# EAGLE design hs_pcb (EAGLE 5.12)
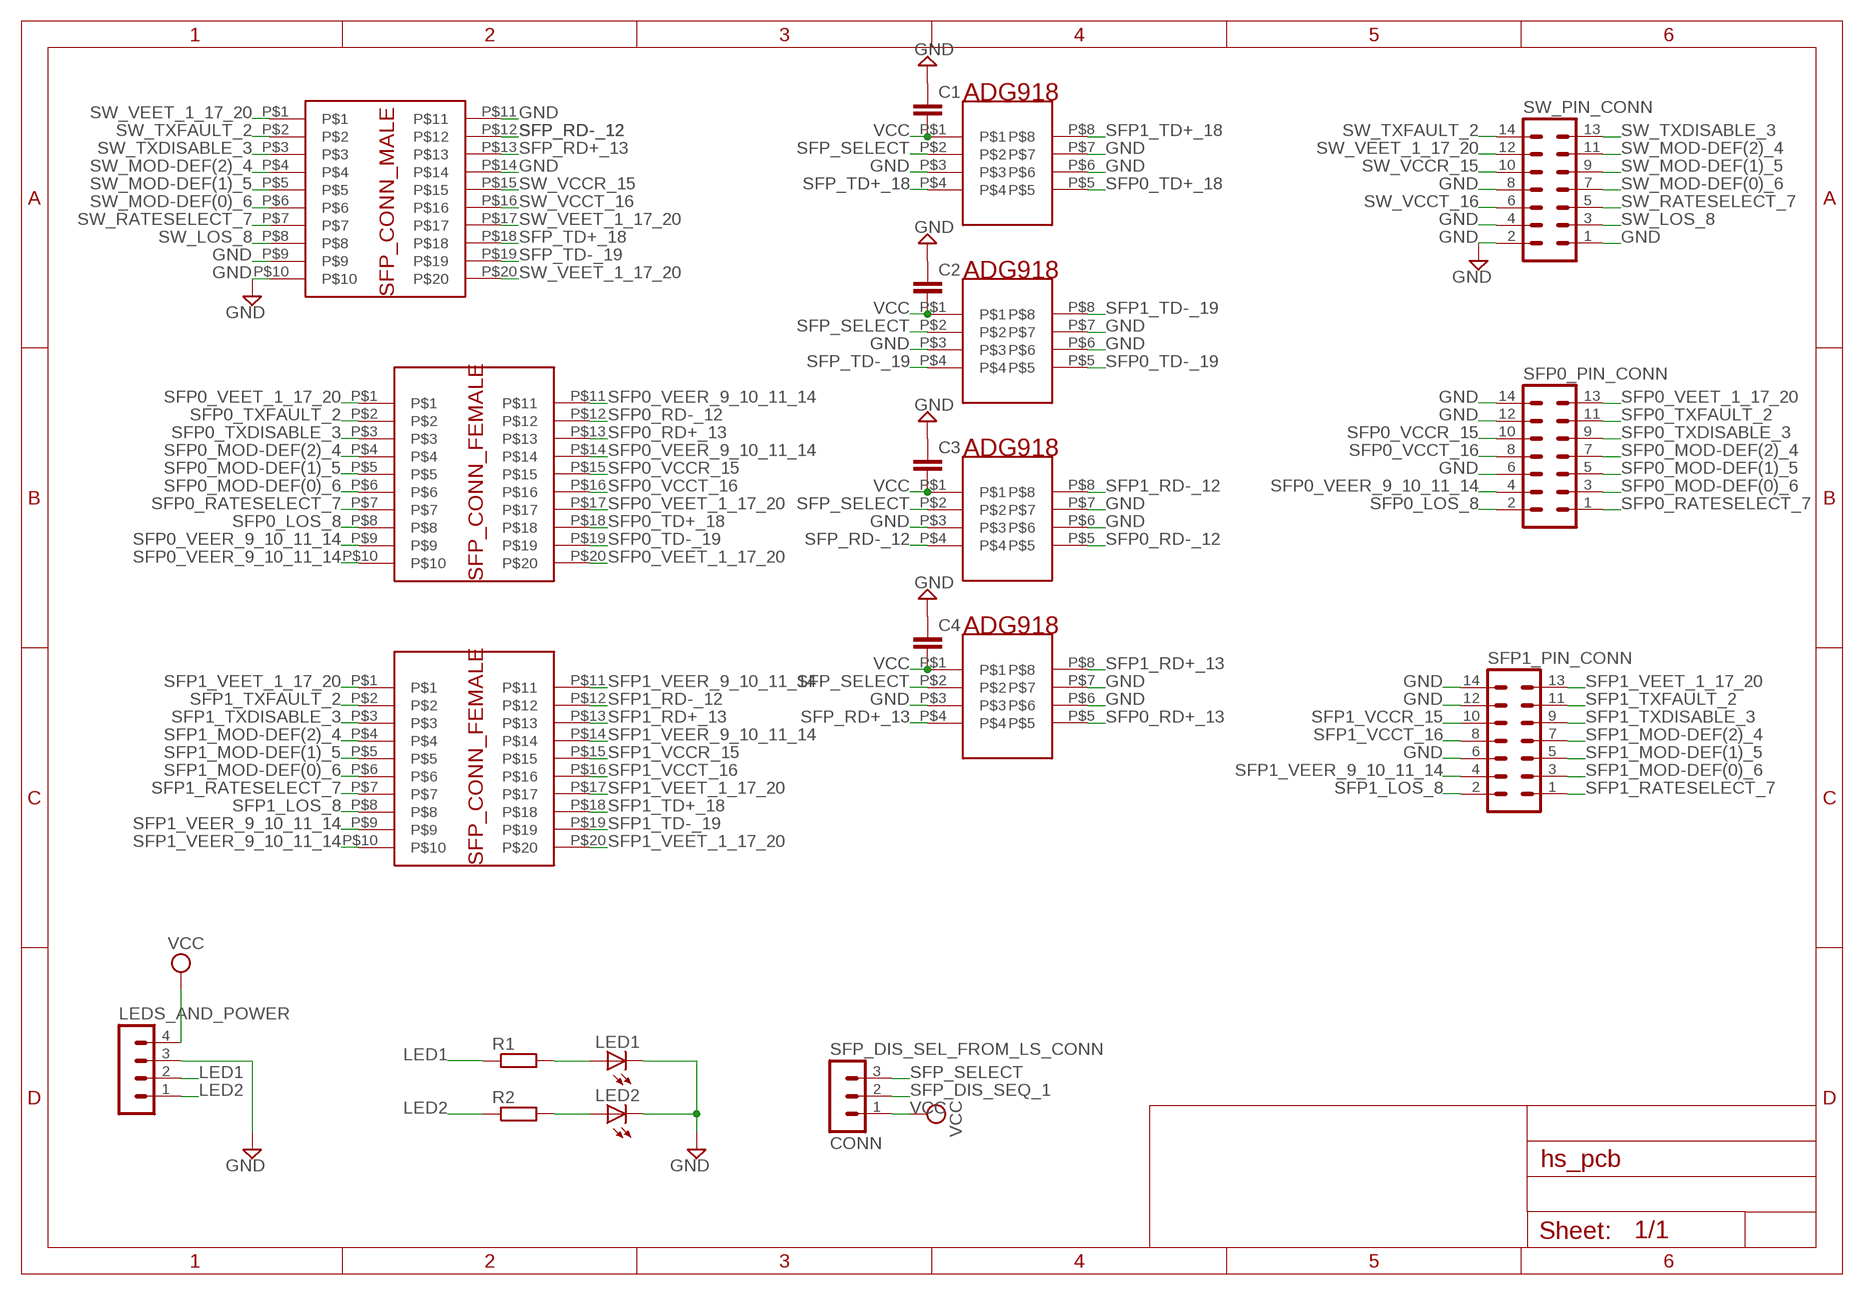
[diagram p0: schematic, sheet 1]

## Parts
C1  C-EUC0805  [C0805]
C2  C-EUC0805  [C0805]
C3  C-EUC0805  [C0805]
C4  C-EUC0805  [C0805]
LED1  LEDCHIP-LED0805  [CHIP-LED0805]
LED2  LEDCHIP-LED0805  [CHIP-LED0805]
LEDS_AND_POWER  MA04-1  [MA04-1]
R1  R-EU_M0805  [M0805]
R2  R-EU_M0805  [M0805]
SFP0_CONN  SFP_CONN  [SFP_CONN]
SFP0_PIN_CONN  MA07-2  [MA07-2]
SFP1_CONN  SFP_CONN  [SFP_CONN]
SFP1_PIN_CONN  MA07-2  [MA07-2]
SFP_DIS_SEL_FROM_LS_CONN  CONN  MA03-1  [MA03-1]
SW_PIN_CONN  MA07-2  [MA07-2]
TO_ETH_SWITCH  SFP_CONN_MALE  [SFP_CONN_MALE]
U$1  ADG918  [ADG918]
U$2  ADG918  [ADG918]
U$4  ADG918  [ADG918]
U$5  ADG918  [ADG918]

## Nets
GND: C1.1 C2.1 C3.1 C4.1 LED1.C LED2.C LEDS_AND_POWER.3 SFP0_PIN_CONN.6 SFP0_PIN_CONN.12 SFP0_PIN_CONN.14 SFP1_PIN_CONN.6 SFP1_PIN_CONN.12 SFP1_PIN_CONN.14 SW_PIN_CONN.1 SW_PIN_CONN.2 SW_PIN_CONN.4 SW_PIN_CONN.8 TO_ETH_SWITCH.P$9 TO_ETH_SWITCH.P$10 TO_ETH_SWITCH.P$11 TO_ETH_SWITCH.P$14 U$1.P$3 U$1.P$6 U$1.P$7 U$2.P$3 U$2.P$6 U$2.P$7 U$4.P$3 U$4.P$6 U$4.P$7 U$5.P$3 U$5.P$6 U$5.P$7
LED1: LEDS_AND_POWER.2 R1.1
LED2: LEDS_AND_POWER.1 R2.1
N$30: LED1.A R1.2
N$31: LED2.A R2.2
SFP0_LOS_8: SFP0_CONN.P$8 SFP0_PIN_CONN.2
SFP0_MOD-DEF(0)_6: SFP0_CONN.P$6 SFP0_PIN_CONN.3
SFP0_MOD-DEF(1)_5: SFP0_CONN.P$5 SFP0_PIN_CONN.5
SFP0_MOD-DEF(2)_4: SFP0_CONN.P$4 SFP0_PIN_CONN.7
SFP0_RATESELECT_7: SFP0_CONN.P$7 SFP0_PIN_CONN.1
SFP0_RD+_13: SFP0_CONN.P$13 U$5.P$5
SFP0_RD-_12: SFP0_CONN.P$12 U$4.P$5
SFP0_TD+_18: SFP0_CONN.P$18 U$1.P$5
SFP0_TD-_19: SFP0_CONN.P$19 U$2.P$5
SFP0_TXDISABLE_3: SFP0_CONN.P$3 SFP0_PIN_CONN.9
SFP0_TXFAULT_2: SFP0_CONN.P$2 SFP0_PIN_CONN.11
SFP0_VCCR_15: SFP0_CONN.P$15 SFP0_PIN_CONN.10
SFP0_VCCT_16: SFP0_CONN.P$16 SFP0_PIN_CONN.8
SFP0_VEER_9_10_11_14: SFP0_CONN.P$9 SFP0_CONN.P$10 SFP0_CONN.P$11 SFP0_CONN.P$14 SFP0_PIN_CONN.4
SFP0_VEET_1_17_20: SFP0_CONN.P$1 SFP0_CONN.P$17 SFP0_CONN.P$20 SFP0_PIN_CONN.13
SFP1_LOS_8: SFP1_CONN.P$8 SFP1_PIN_CONN.2
SFP1_MOD-DEF(0)_6: SFP1_CONN.P$6 SFP1_PIN_CONN.3
SFP1_MOD-DEF(1)_5: SFP1_CONN.P$5 SFP1_PIN_CONN.5
SFP1_MOD-DEF(2)_4: SFP1_CONN.P$4 SFP1_PIN_CONN.7
SFP1_RATESELECT_7: SFP1_CONN.P$7 SFP1_PIN_CONN.1
SFP1_RD+_13: SFP1_CONN.P$13 U$5.P$8
SFP1_RD-_12: SFP1_CONN.P$12 U$4.P$8
SFP1_TD+_18: SFP1_CONN.P$18 U$1.P$8
SFP1_TD-_19: SFP1_CONN.P$19 U$2.P$8
SFP1_TXDISABLE_3: SFP1_CONN.P$3 SFP1_PIN_CONN.9
SFP1_TXFAULT_2: SFP1_CONN.P$2 SFP1_PIN_CONN.11
SFP1_VCCR_15: SFP1_CONN.P$15 SFP1_PIN_CONN.10
SFP1_VCCT_16: SFP1_CONN.P$16 SFP1_PIN_CONN.8
SFP1_VEER_9_10_11_14: SFP1_CONN.P$9 SFP1_CONN.P$10 SFP1_CONN.P$11 SFP1_CONN.P$14 SFP1_PIN_CONN.4
SFP1_VEET_1_17_20: SFP1_CONN.P$1 SFP1_CONN.P$17 SFP1_CONN.P$20 SFP1_PIN_CONN.13
SFP_DIS_SEQ_1: SFP_DIS_SEL_FROM_LS_CONN.2
SFP_RD+_13: TO_ETH_SWITCH.P$13 U$5.P$4
SFP_RD-_12: TO_ETH_SWITCH.P$12 U$4.P$4
SFP_SELECT: SFP_DIS_SEL_FROM_LS_CONN.3 U$1.P$2 U$2.P$2 U$4.P$2 U$5.P$2
SFP_TD+_18: TO_ETH_SWITCH.P$18 U$1.P$4
SFP_TD-_19: TO_ETH_SWITCH.P$19 U$2.P$4
SW_LOS_8: SW_PIN_CONN.3 TO_ETH_SWITCH.P$8
SW_MOD-DEF(0)_6: SW_PIN_CONN.7 TO_ETH_SWITCH.P$6
SW_MOD-DEF(1)_5: SW_PIN_CONN.9 TO_ETH_SWITCH.P$5
SW_MOD-DEF(2)_4: SW_PIN_CONN.11 TO_ETH_SWITCH.P$4
SW_RATESELECT_7: SW_PIN_CONN.5 TO_ETH_SWITCH.P$7
SW_TXDISABLE_3: SW_PIN_CONN.13 TO_ETH_SWITCH.P$3
SW_TXFAULT_2: SW_PIN_CONN.14 TO_ETH_SWITCH.P$2
SW_VCCR_15: SW_PIN_CONN.10 TO_ETH_SWITCH.P$15
SW_VCCT_16: SW_PIN_CONN.6 TO_ETH_SWITCH.P$16
SW_VEET_1_17_20: SW_PIN_CONN.12 TO_ETH_SWITCH.P$1 TO_ETH_SWITCH.P$17 TO_ETH_SWITCH.P$20
VCC: C1.2 C2.2 C3.2 C4.2 LEDS_AND_POWER.4 SFP_DIS_SEL_FROM_LS_CONN.1 U$1.P$1 U$2.P$1 U$4.P$1 U$5.P$1

## Library data of the parts
C1-C4 = rcl:C-EU: CAPACITOR, European symbol
LED1 LED2 = led:LED: LED OSRAM: - CHIPLED LG R971, LG N971, LY N971, LG Q971, LY Q971, LO R971, LY R971 LH N974, LH R974 LS Q976, LO Q976, LY Q976 LO Q996 - Hyper CHIPLED LW Q18S LB Q993, LB Q99A, LB R99A - SideLED LS A670, LO A670, LY A670, LG A670, LP A670 LB A673, LV A673, LT A673, LW A673 LH A674 LY A675 LS A676, LA A676, LO A676, LY A676, LW A676 LS A679, LY A679, LG A679 - Hyper Micro SIDELED® LS Y876, LA Y876, LO Y876, LY Y876 LT Y87S - SmartLED LW L88C, LW L88S LB L89C, LB L89S, LG L890 LS L89K, LO L89K, LY L89K LS L896, LA L896, LO L896, LY L896 - TOPLED LS T670, LO T670, LY T670, LG T670, LP T670 LSG T670, LSP T670, LSY T670, LOP T670, LYG T670 LG T671, LOG T671, LSG T671 LB T673, LV T673, LT T673, LW T673 LH T674 LS T676, LA T676, LO T676, LY T676, LB T676, LH T676, LSB T676, LW T676 LB T67C, LV T67C, LT T67C, LS T67K, LO T67K, LY T67K, LW E67C LS E67B, LA E67B, LO E67B, LY E67B, LB E67C, LV E67C, LT E67C LW T67C LS T679, LY T679, LG T679 LS T770, LO T770, LY T770, LG T770, LP T770 LB T773, LV T773, LT T773, LW T773 LH T774 LS E675, LA E675, LY E675, LS T675 LS T776, LA T776, LO T776, LY T776, LB T776 LHGB T686 LT T68C, LB T68C - Hyper Mini TOPLED® LB M676 - Mini TOPLED Santana® LG M470 LS M47K, LO M47K, LY M47K Source: http://www.osram.convergy.de LUXEON: - LUMILED® LXK2-PW12-R00, LXK2-PW12-S00, LXK2-PW14-U00, LXK2-PW14-V00 LXK2-PM12-R00, LXK2-PM12-S00, LXK2-PM14-U00 LXK2-PE12-Q00, LXK2-PE12-R00, LXK2-PE12-S00, LXK2-PE14-T00, LXK2-PE14-U00 LXK2-PB12-K00, LXK2-PB12-L00, LXK2-PB12-M00, LXK2-PB14-N00, LXK2-PB14-P00, LXK2-PB14-Q00 LXK2-PR12-L00, LXK2-PR12-M00, LXK2-PR14-Q00, LXK2-PR14-R00 LXK2-PD12-Q00, LXK2-PD12-R00, LXK2-PD12-S00 LXK2-PH12-R00, LXK2-PH12-S00 LXK2-PL12-P00, LXK2-PL12-Q00, LXK2-PL12-R00 Source: www.luxeon.com KINGBRIGHT: KA-3528ASYC Source: www.kingbright.com
LEDS_AND_POWER = con-lstb:MA04-1: PIN HEADER; OC_FARNELL: unknown; OC_NEWARK: unknown
R1 R2 = rcl:R-EU_: RESISTOR, European symbol
SFP0_CONN SFP1_CONN = sfp:SFP_CONN
SFP0_PIN_CONN SFP1_PIN_CONN SW_PIN_CONN = con-lstb:MA07-2: PIN HEADER; OC_FARNELL: unknown; OC_NEWARK: unknown
SFP_DIS_SEL_FROM_LS_CONN = con-lstb:MA03-1: PIN HEADER; OC_FARNELL: unknown; OC_NEWARK: unknown
TO_ETH_SWITCH = sfp:SFP_CONN_MALE
U$1 U$2 U$4 U$5 = analogDevices:ADG918

## Net classes
0 default: width 0.508 mm, drill 0.508 mm, clearance 0.508 mm

## Board
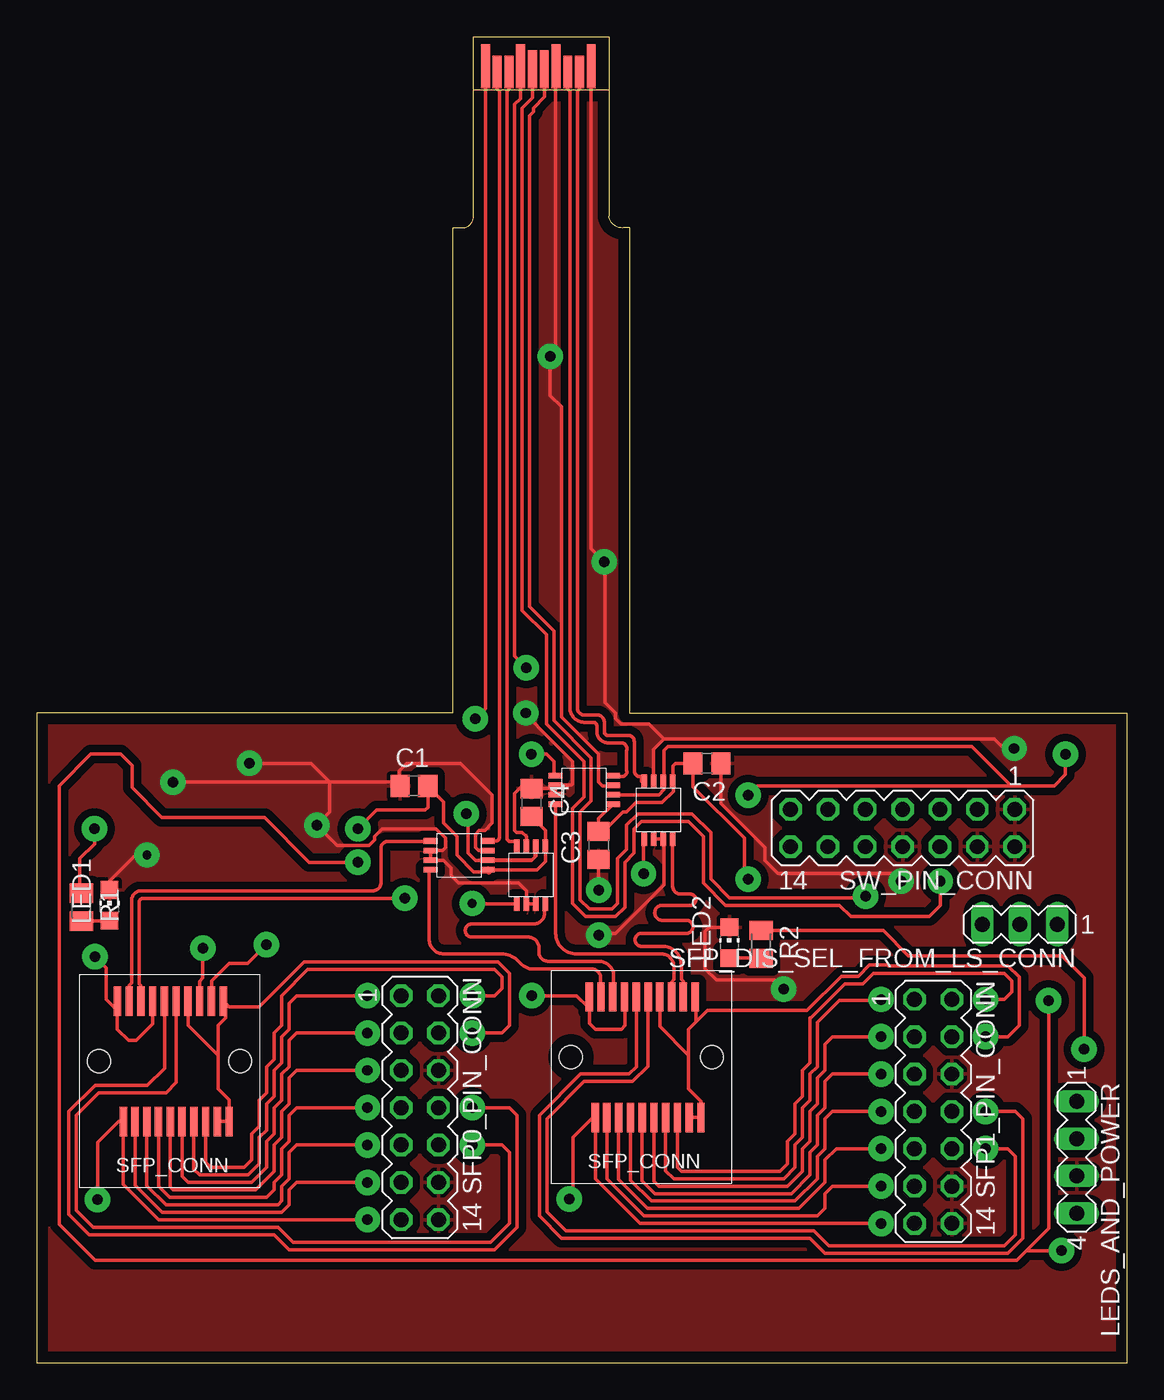
[diagram p1: board, top side]
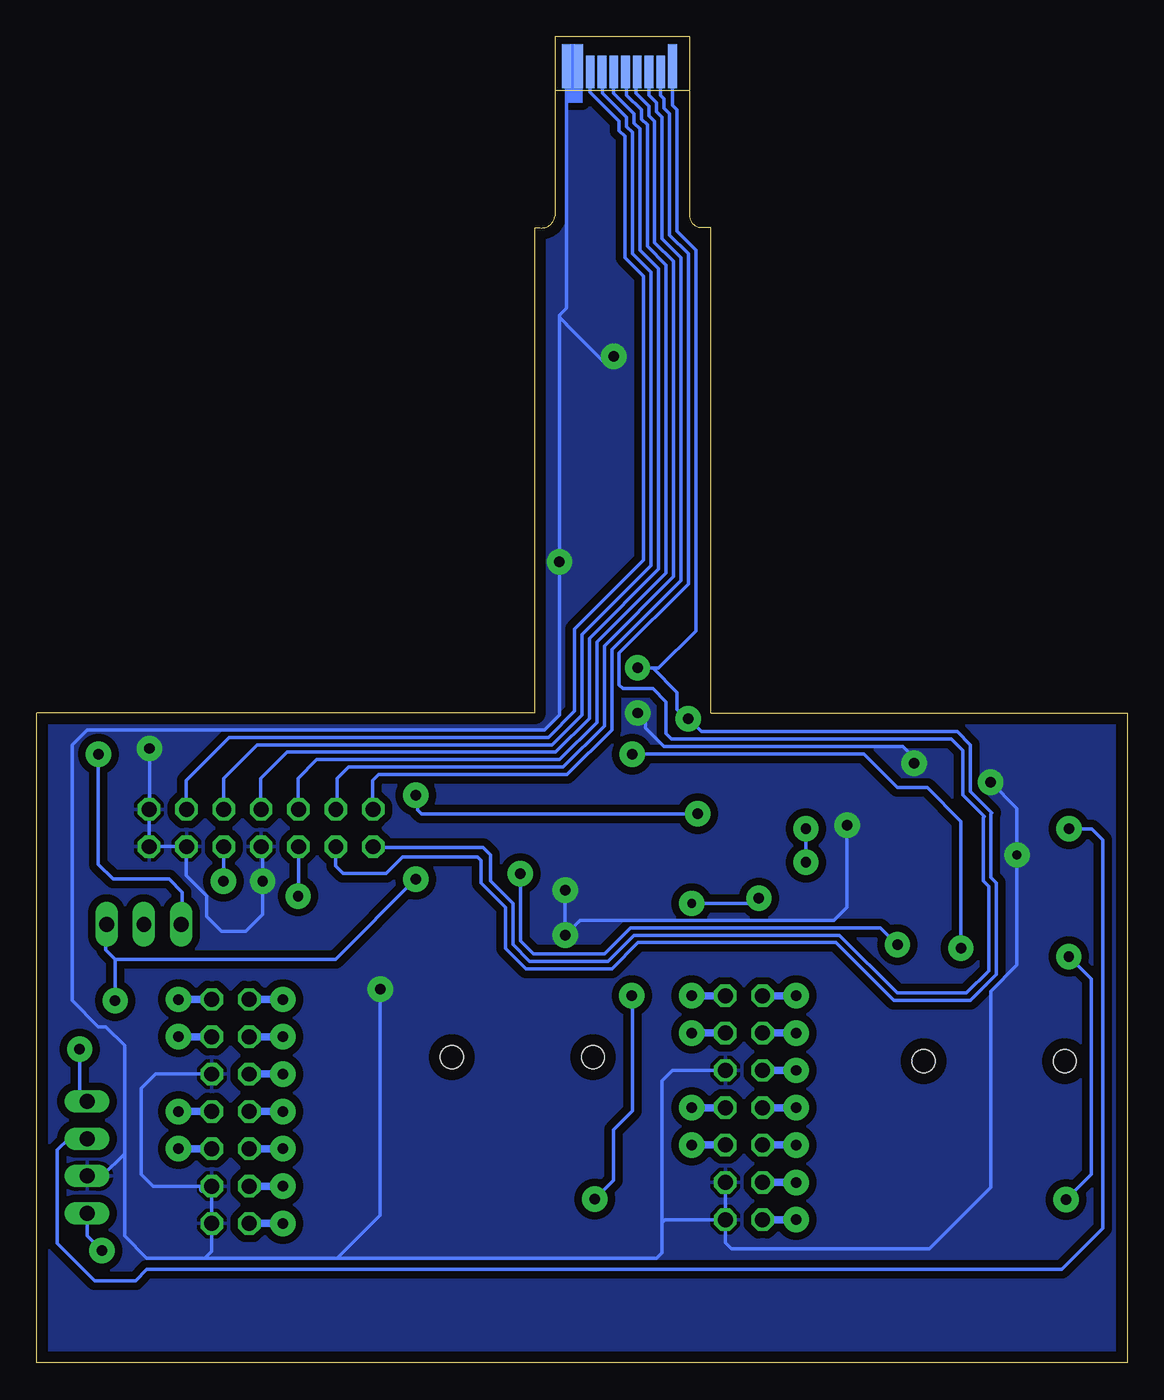
[diagram p2: board, bottom side, seen from below]

Size 74.17 x 90.2 mm. Coordinates in mm from the lower left corner, seen from the top.
Outline: 40.32,44.2 40.32,77.2 39.92,77.2 arc-90 38.92,78 38.92,90.2 29.72,90.2 29.72,78 arc-90 28.92,77.2 28.32,77.2 28.32,44.2 0,44.2 0,0 74.17,0 74.17,44.2 40.32,44.2
Copper layers (1*16): Top 0.035mm / dielectric 1.5mm / Bottom 0.035mm
Design rules "default *": minimum track width 10mil, minimum drill 28mil, track to track 10mil, track to pad 10mil, pad to pad 10mil, via to via 10mil, smd to smd 10mil, copper to edge 30mil, drill to drill 10mil, minimum pad ring 10mil, minimum via ring 8mil, stop-mask expansion 4mil, vias tented up to drill 0mil, thermal gap 10mil

### Footprints (pad centres in the part's own frame; a part is rotated, then mirrored left to right if it is on the bottom)
C0805 = smd 1.3 x 1.5: 1 -0.95,0; 2 0.95,0
CHIP-LED0805 = smd 1.2 x 1.2: A 0,-1.05; C 0,1.05
MA04-1 = drill 1.016 long: 1 -3.81,0; 2 -1.27,0; 3 1.27,0; 4 3.81,0
M0805 = smd 1.3 x 1.6: 1 -0.95,0; 2 0.95,0
SFP_CONN = smd 0.5 x 2: P$1 -3.12,-2.6; P$2 -2.32,-2.6; P$3 -1.52,-2.6; P$4 -0.72,-2.6; P$5 0.08,-2.6; P$6 0.88,-2.6; P$7 1.68,-2.6; P$8 2.48,-2.6; P$9 3.28,-2.6; P$10 4.08,-2.6; P$11 3.68,5.6; P$12 2.88,5.6; P$13 2.08,5.6; P$14 1.28,5.6; P$15 0.48,5.6; P$16 -0.32,5.6; P$17 -1.12,5.6; P$18 -1.92,5.6; P$19 -2.72,5.6; P$20 -3.52,5.6 | hole 1.55: -4.77,1.5; 4.83,1.5
MA07-2 = drill 1.016 octagon: 1 -7.62,-1.27; 2 -7.62,1.27; 3 -5.08,-1.27; 4 -5.08,1.27; 5 -2.54,-1.27; 6 -2.54,1.27; 7 0,-1.27; 8 0,1.27; 9 2.54,-1.27; 10 2.54,1.27; 11 5.08,-1.27; 12 5.08,1.27; 13 7.62,-1.27; 14 7.62,1.27
MA03-1 = drill 1.016 long: 1 -2.54,0; 2 0,0; 3 2.54,0
SFP_CONN_MALE = smd 3 x 0.6 bottom: P$1 0.2,3.35; P$9 0.2,-3.05; P$10 0.2,-3.85 | smd 2.2 x 0.6 bottom: P$2 -0.2,2.55; P$3 -0.2,1.75; P$4 -0.2,0.95; P$5 -0.2,0.15; P$6 -0.2,-0.65; P$7 -0.2,-1.45; P$8 -0.2,-2.25 | smd 3 x 0.6: P$11 0.2,-3.45; P$14 0.2,-1.05; P$17 0.2,1.35; P$20 0.2,3.75 | smd 2.2 x 0.6: P$12 -0.2,-2.65; P$13 -0.2,-1.85; P$18 -0.2,2.15; P$19 -0.2,2.95 | smd 2.6 x 0.6: P$15 0,-0.25; P$16 0,0.55
ADG918 = smd 0.38 x 0.95: P$1 -0.95,-1.95; P$2 -0.3,-1.95; P$3 0.35,-1.95; P$4 1,-1.95; P$5 1,1.95; P$6 0.35,1.95; P$7 -0.3,1.95; P$8 -0.95,1.95

### Placement (x,y rotation side)
C1  25.65,39.24 0 top
C2  45.59,40.77 180 top
C3  38.23,35.18 90 top
C4  33.66,38.1 270 top
LED1  4.95,31.12 0 top
LED2  47.12,28.58 0 top
LEDS_AND_POWER  70.74,13.97 270 top
R1  3.05,30.99 270 top
R2  49.28,28.45 270 top
SFP0_CONN  9.01,19.01 0 top
SFP0_PIN_CONN  26.06,17.35 270 top
SFP1_CONN  41.1,19.28 0 top
SFP1_PIN_CONN  60.99,17.09 270 top
SFP_DIS_SEL_FROM_LS_CONN  66.88,29.82 180 top
SW_PIN_CONN  58.9,36.37 180 top
TO_ETH_SWITCH  34.27,88 90 top
U$1  33.66,33.17 180 top
U$2  28.73,34.49 90 top
U$4  42.32,37.59 180 top
U$5  37.24,38.94 90 top

### Tracks (layer width: path | path; a pad name or v marks a point on that pad's centre or on a via)
GND  (via drill 0.6 pad 1.73, 0.71 pad 1.73)
  Top 0.254: U$1.P$7 U$1.P$6 33.3,32.1 32.77,32.64 28.7,32.64 28.19,33.15 28.19,33.66 27.69,34.16 26.81,34.16 U$2.P$7 U$2.P$6 27.6,34.84 27.81,35.05 27.81,35.69 27.18,36.32 23.5,36.32 22.99,35.81 22.99,35.56 22.61,35.18 20.45,35.18 v19.05,36.58 19.94,37.47 19.94,39.5 | TO_ETH_SWITCH.P$14 35.31,68.83 v34.93,68.45 34.93,65.79 35.69,65.02 35.69,43.94 38.23,41.4 38.23,39.5 38.48,39.24 39.14,39.24 U$5.P$3 | v66.5,41.78 65.79,41.78 65.15,42.42 42.67,42.42 | U$4.P$3 41.97,41.71 42.67,42.42 | C1.1 24.77,39.18 | U$1.P$3 33.3,35.78 33.02,36.07 32.64,36.07 32.51,36.2 32.51,38.73 32.89,39.12 33.59,39.12 C4.1 34.88,39.05 U$5.P$7 U$5.P$6 36.37,39.29 36.45,39.37 36.45,40.89 34.16,43.18 v33.27,44.2 | U$4.P$7 U$4.P$6 | U$4.P$7 42.63,35.64 42.67,35.69 | v38.23,32.13 C3.1 | v38.23,29.08 38.73,29.21 39.37,29.21 42.67,32.51 42.67,35.59 U$4.P$7 | U$2.P$3 30.05,34.84 29.84,35.05 29.84,35.94 30.1,36.2 30.48,36.2 30.99,36.7 30.99,38.61 28.83,40.77 25.15,40.77 24.64,40.26 24.64,39.31 C1.1 | C2.1 46.54,38.04 49.53,35.05 49.53,34.16 50.42,33.27 58.29,33.27 v58.8,32.77 | v9.27,39.5 19.94,39.5 | 19.94,39.5 24.45,39.5 C1.1 | v14.48,40.77 18.67,40.77 19.94,39.5 | TO_ETH_SWITCH.P$11 37.72,55.37 v38.61,54.48 38.67,54.42 38.67,44.89 39.37,44.2 39.37,43.81 39.75,43.43 41.66,43.43 42.67,42.42 | v50.8,25.4 50.16,26.03 46.23,26.03 45.47,26.8 45.47,29.34 45.75,29.62 LED2.C | LED1.C 4.95,32.77 6.73,34.54 v7.49,34.54
  Bottom 0.254: 66.5,42.29 v66.5,41.78 66.5,37.67 SW_PIN_CONN.1 SW_PIN_CONN.2 SW_PIN_CONN.4 64.01,35.08 64.01,33.15 62.61,31.75 62.61,30.35 61.59,29.34 59.94,29.34 58.8,30.48 v58.8,32.77 58.8,35 SW_PIN_CONN.8 | v38.23,32.13 v38.23,29.08 37.21,30.1 19.94,30.1 19.05,30.99 v19.05,36.58 | v34.93,68.45 34.93,68.09 35.6,68.09 38.12,70.61 38.12,70.63 38.61,71.12 | v9.27,39.5 7.49,37.72 v7.49,34.54 7.49,27.05 9.27,25.27 9.27,11.94 13.46,7.75 26.92,7.75 27.33,8.15 SFP0_PIN_CONN.14 | v14.48,40.77 14.48,41.15 15.24,41.91 31.5,41.91 32.77,43.18 32.77,43.69 v33.27,44.2 | 62.74,7.11 62.25,7.6 SFP1_PIN_CONN.14 SFP1_PIN_CONN.12 66.24,12.01 67.06,12.83 67.06,18.67 66.09,19.63 SFP1_PIN_CONN.6 | TO_ETH_SWITCH.P$9 TO_ETH_SWITCH.P$10 38.12,71.73 38.61,71.25 38.61,71.12 | 38.61,71.12 v38.61,54.48 38.61,44.07 39.62,43.05 70.74,43.05 71.75,42.04 71.75,24.64 69.98,22.86 69.47,22.86 68.2,21.59 68.2,14.22 | SFP0_PIN_CONN.6 30.91,19.89 31.62,19.18 31.62,9.53 | 53.72,7.11 32,7.11 31.62,7.49 31.62,9.53 | 53.72,7.11 62.74,7.11 | SFP0_PIN_CONN.14 SFP0_PIN_CONN.12 | SFP0_PIN_CONN.14 31.42,9.73 31.62,9.53 | v50.8,25.4 50.8,10.03 53.72,7.11 | 62.74,7.11 66.67,7.11 68.2,8.64 68.2,14.22 | LEDS_AND_POWER.3 69.72,12.7 68.2,14.22
  Bottom 0.508: SFP1_PIN_CONN.12 62.87,11.81 | SW_PIN_CONN.8 58.8,35.05
  pour Top: 0,0 0,43.94 0.25,44.2 28.32,44.2 28.32,77.09 29.72,77.09 29.72,86.49 38.86,86.49 38.86,77.22 40.26,77.22 40.26,44.2 74.17,44.2 74.17,0
  pour Bottom: 0,0 0,44.2 28.07,44.2 arc90 28.32,44.45 28.32,77.22 29.46,77.22 arc90 29.72,77.47 29.72,86.49 38.61,86.49 arc-90 38.86,86.23 38.86,77.22 40.01,77.22 arc-90 40.26,76.96 40.26,44.2 74.04,44.07 arc-90 74.04,42.8 74.17,0
LED1  (via drill 0.71 pad 1.73)
  Top 0.254: v3.94,36.32 3.94,35.31 2.92,34.29 2.92,32.06 R1.1
  Bottom 0.254: LEDS_AND_POWER.2 72.01,15.24 72.77,14.48 72.77,8.13 70.23,5.59 67.44,5.59 66.67,6.35 4.45,6.35 1.65,9.14 1.65,35.56 2.41,36.32 v3.94,36.32
LED2  (via drill 0.71 pad 1.73)
  Top 0.254: R2.1 57.6,29.4 59.31,27.69 69.72,27.69 71.25,26.16 v71.25,21.34
  Bottom 0.254: v71.25,21.34 71.25,18.29 LEDS_AND_POWER.1
N$5  (via drill 0.71 pad 1.73)
  other vias: 22.5,17.35
N$30
  Top 0.254: R1.2 4.93,30.04 LED1.A
N$31
  Top 0.254: LED2.A 49.25,27.52 R2.2
SFP0_LOS_8  (via drill 0.71 pad 1.73)
  Top 0.254: SFP0_CONN.P$8 11.49,13.63 11.84,13.28 14.12,13.28 14.63,13.79 14.63,15.57 15.14,16.08 15.14,17.86 15.65,18.36 15.65,20.14 16.15,20.65 16.15,22.43 16.66,22.94 16.66,24.97 18.44,26.75 31.14,26.75 31.65,26.24 31.65,25.48 31.14,24.97 v29.62,24.97
  Bottom 0.508: v29.62,24.97 SFP0_PIN_CONN.2
SFP0_MOD-DEF(0)_6  (via drill 0.71 pad 1.73)
  Top 0.254: SFP0_CONN.P$6 9.89,12.69 10.31,12.27 14.63,12.27 15.65,13.28 15.65,15.06 16.15,15.57 16.15,17.35 16.66,17.86 16.66,19.63 17.17,20.14 17.17,21.92 17.68,22.43 v22.5,22.43
  Bottom 0.508: v22.5,22.43 SFP0_PIN_CONN.3
SFP0_MOD-DEF(1)_5  (via drill 0.71 pad 1.73)
  Top 0.254: SFP0_CONN.P$5 9.09,11.97 9.3,11.76 14.88,11.76 16.15,13.03 16.15,14.81 16.66,15.32 16.66,17.09 17.17,17.6 17.17,19.38 17.68,19.89 v22.5,19.89
  Bottom 0.508: v22.5,19.89 SFP0_PIN_CONN.5
SFP0_MOD-DEF(2)_4  (via drill 0.71 pad 1.73)
  Top 0.254: SFP0_CONN.P$4 8.29,12.01 9.04,11.25 15.65,11.25 16.15,11.76 16.15,12.27 16.66,12.78 16.66,14.55 17.17,15.06 17.17,16.84 17.68,17.35 v22.5,17.35
  Bottom 0.508: v22.5,17.35 SFP0_PIN_CONN.7
SFP0_RATESELECT_7  (via drill 0.71 pad 1.73)
  Top 0.254: SFP0_CONN.P$7 10.69,13.16 11.07,12.78 14.38,12.78 15.14,13.54 15.14,15.32 15.65,15.82 15.65,17.6 16.15,18.11 16.15,19.89 16.66,20.4 16.66,22.17 17.17,22.68 17.17,24.46 17.68,24.97 v22.5,24.97
  Bottom 0.508: v22.5,24.97 SFP0_PIN_CONN.1
SFP0_RD+_13  (via drill 0.71 pad 1.73)
  Top 0.254: SFP0_CONN.P$13 11.09,25.95 11.3,26.16 v11.3,28.19 | v33.66,41.4 34.67,41.4 35.18,40.89 35.18,40.05 U$5.P$5
  Bottom 0.254: v33.66,41.4 17.91,41.4 15.62,39.12 13.59,39.12 11.3,36.83 v11.3,28.19
SFP0_RD-_12  (via drill 0.71 pad 1.73)
  Top 0.254: SFP0_CONN.P$12 11.89,25.98 13.08,27.18 14.35,27.18 v15.62,28.45 | v41.28,33.27 41.28,35.6 U$4.P$5
  Bottom 0.254: v15.62,28.45 16.76,29.59 33.78,29.59 35.56,27.81 40.39,27.81 41.28,28.7 v41.28,33.27
SFP0_TD+_18  (via drill 0.6 pad 1.73, 0.71 pad 1.73)
  Top 0.254: SFP0_CONN.P$18 7.09,25.65 6.96,25.78 6.96,31.29 arc-95 7.29,31.6 v25.04,31.6 | U$1.P$5 29.62,31.22 v29.62,31.24
  Bottom 0.254: v29.62,31.24 25.4,31.24 v25.04,31.6
SFP0_TD-_19
  Top 0.254: SFP0_CONN.P$19 6.29,25.67 6.45,25.83 6.45,31.42 arc-92 7.11,32.11 22.86,32.11 arc97 23.42,32.74 23.42,35 arc-99 23.95,35.46 26.78,35.46 U$2.P$5
SFP0_TXDISABLE_3  (via drill 0.71 pad 1.73)
  Top 0.254: SFP0_CONN.P$3 7.49,12.05 8.79,10.74 16.41,10.74 16.66,11 16.66,12.01 17.17,12.52 17.17,14.3 17.68,14.81 v22.5,14.81
  Bottom 0.508: v22.5,14.81 SFP0_PIN_CONN.9
SFP0_TXFAULT_2  (via drill 0.71 pad 1.73)
  Top 0.254: SFP0_CONN.P$2 6.69,12.08 8.53,10.24 16.66,10.24 17.17,10.74 17.17,11.76 17.68,12.27 v22.5,12.27
  Bottom 0.508: v22.5,12.27 SFP0_PIN_CONN.11
SFP0_VCCR_15  (via drill 0.71 pad 1.73)
  Top 0.254: SFP0_CONN.P$15 9.49,19.06 8.79,18.36 4.22,18.36 2.69,16.84 2.69,10.36 3.84,9.22 16.41,9.22 17.42,8.2 30.89,8.2 32.16,9.47 32.16,14.3 31.65,14.81 v29.62,14.81
  Bottom 0.508: v29.62,14.81 SFP0_PIN_CONN.10
SFP0_VCCT_16  (via drill 0.71 pad 1.73)
  Top 0.254: SFP0_CONN.P$16 8.69,20.04 7.52,18.87 3.96,18.87 2.18,17.09 2.18,10.08 3.56,8.71 16.15,8.71 17.17,7.7 31.14,7.7 32.66,9.22 32.66,16.84 32.16,17.35 v29.62,17.35
  Bottom 0.508: v29.62,17.35 SFP0_PIN_CONN.8
SFP0_VEER_9_10_11_14  (via drill 0.71 pad 1.73)
  Top 0.254: SFP0_CONN.P$9 SFP0_CONN.P$10 13.09,17.88 12.34,18.62 12.34,20.9 | 12.34,20.9 12.34,22.94 12.85,23.44 12.85,24.44 SFP0_CONN.P$11 13.09,24.21 15.14,24.21 18.19,27.25 31.39,27.25 32.16,26.49 32.16,22.94 31.65,22.43 v29.62,22.43 | SFP0_CONN.P$14 10.29,22.96 12.34,20.9
  Bottom 0.508: v29.62,22.43 SFP0_PIN_CONN.4
SFP0_VEET_1_17_20  (via drill 0.71 pad 1.73)
  Top 0.254: SFP0_CONN.P$17 7.89,23.05 6.76,21.92 6.25,21.92 5.49,22.68 5.49,23.95 | 5.49,23.95 SFP0_CONN.P$20 | 5.49,23.95 4.72,24.71 4.72,26.87 v3.96,27.63 | v22.5,9.73 8.28,9.73 5.89,12.12 SFP0_CONN.P$1 5.56,16.41 4.14,14.99 v4.14,11.1
  Bottom 0.254: v3.96,27.63 2.44,26.11 2.44,12.8 v4.14,11.1
  Bottom 0.508: v22.5,9.73 SFP0_PIN_CONN.13
SFP1_LOS_8  (via drill 0.71 pad 1.73)
  Top 0.254: SFP1_CONN.P$8 43.58,13.29 43.84,13.03 50.57,13.03 51.08,13.54 51.08,15.06 51.59,15.57 51.59,17.6 52.09,18.11 52.09,19.89 52.6,20.4 52.6,23.44 52.65,23.44 54.99,25.78 56.21,25.78 56.92,26.49 65.81,26.49 66.32,25.98 66.32,25.22 65.81,24.71 v64.54,24.71
  Bottom 0.508: v64.54,24.71 SFP1_PIN_CONN.2
SFP1_MOD-DEF(0)_6  (via drill 0.71 pad 1.73)
  Top 0.254: SFP1_CONN.P$6 41.98,12.35 42.32,12.01 51.08,12.01 52.09,13.03 52.09,14.55 52.6,15.06 52.6,17.09 53.11,17.6 53.11,19.38 53.62,19.89 53.62,21.67 54.13,22.17 v57.43,22.17
  Bottom 0.508: v57.43,22.17 SFP1_PIN_CONN.3
SFP1_MOD-DEF(1)_5  (via drill 0.71 pad 1.73)
  Top 0.254: SFP1_CONN.P$5 41.18,12.38 42.06,11.51 51.33,11.51 52.6,12.78 52.6,14.3 53.11,14.81 53.11,16.84 53.62,17.35 53.62,19.13 54.13,19.63 v57.43,19.63
  Bottom 0.508: v57.43,19.63 SFP1_PIN_CONN.5
SFP1_MOD-DEF(2)_4  (via drill 0.71 pad 1.73)
  Top 0.254: SFP1_CONN.P$4 40.38,12.42 41.81,11 51.59,11 53.11,12.52 53.11,14.05 53.62,14.55 53.62,16.59 54.13,17.09 v57.43,17.09
  Bottom 0.508: v57.43,17.09 SFP1_PIN_CONN.7
SFP1_RATESELECT_7  (via drill 0.71 pad 1.73)
  Top 0.254: SFP1_CONN.P$7 42.78,13.07 43.33,12.52 50.83,12.52 51.59,13.28 51.59,14.81 52.09,15.32 52.09,17.35 52.6,17.86 52.6,19.63 53.11,20.14 53.11,23.14 54.61,24.64 57.35,24.64 v57.43,24.71
  Bottom 0.508: v57.43,24.71 SFP1_PIN_CONN.1
SFP1_RD+_13
  Top 0.254: SFP1_CONN.P$13 43.18,25.89 43.33,26.06 43.33,26.95 arc93 42.42,27.81 36.7,27.81 arc-95 35.31,29.34 35.31,29.97 35.31,30.23 35.31,37.99 U$5.P$8 35.26,37.99
SFP1_RD-_12
  Top 0.254: SFP1_CONN.P$12 43.98,25.94 43.84,26.09 43.84,27.08 arc92 42.55,28.32 41.15,28.32 arc-180 41.15,29.21 44.2,29.21 arc180 44.2,30.1 42.55,30.1 arc-180 42.55,31.12 44.45,31.12 arc180 44.45,31.88 43.82,31.88 arc-95 43.26,32.49 43.26,33.33 43.26,33.6 43.26,35.63 U$4.P$8
SFP1_TD+_18
  Top 0.254: 34.54,31.22 U$1.P$8 34.54,31.16 34.54,30.61 arc-90 33.78,29.84 29.59,29.84 arc180 29.59,28.96 33.4,28.96 arc-102 34.16,28.07 arc100 34.8,27.3 38.23,27.3 arc-97 39.24,26.16 39.24,25.65 39.18,25.65 SFP1_CONN.P$18
SFP1_TD-_19
  Top 0.254: U$2.P$8 26.7,33.46 26.7,28.8 arc90 27.69,27.81 31.62,27.81 arc-48 32.77,27.3 arc28 33.53,26.8 37.72,26.8 arc-100 38.35,26.03 38.35,24.88 SFP1_CONN.P$19
SFP1_TXDISABLE_3  (via drill 0.71 pad 1.73)
  Top 0.254: SFP1_CONN.P$3 39.58,12.46 41.55,10.49 51.84,10.49 53.62,12.27 53.62,13.79 54.38,14.55 v57.43,14.55
  Bottom 0.508: v57.43,14.55 SFP1_PIN_CONN.9
SFP1_TXFAULT_2  (via drill 0.71 pad 1.73)
  Top 0.254: SFP1_CONN.P$2 38.78,12.5 41.3,9.98 53.11,9.98 53.62,10.49 53.62,11.51 54.13,12.01 v57.43,12.01
  Bottom 0.508: v57.43,12.01 SFP1_PIN_CONN.11
SFP1_VCCR_15  (via drill 0.71 pad 1.73)
  Top 0.254: SFP1_CONN.P$15 41.58,20.17 40.54,19.13 37.24,19.13 34.7,16.59 34.7,10.26 35.99,8.97 52.86,8.97 53.87,7.95 65.81,7.95 66.57,8.71 66.57,14.05 66.06,14.55 v64.54,14.55
  Bottom 0.508: v64.54,14.55 SFP1_PIN_CONN.10
SFP1_VCCT_16  (via drill 0.71 pad 1.73)
  Top 0.254: SFP1_CONN.P$16 40.78,20.13 40.28,19.63 36.98,19.63 34.19,16.84 34.19,9.98 35.71,8.46 52.6,8.46 53.62,7.44 66.06,7.44 67.08,8.46 67.08,16.59 66.57,17.09 v64.54,17.09
  Bottom 0.508: v64.54,17.09 SFP1_PIN_CONN.8
SFP1_VEER_9_10_11_14  (via drill 0.71 pad 1.73)
  Top 0.254: SFP1_CONN.P$9 SFP1_CONN.P$10 45.18,17.78 44.35,18.62 44.35,20.9 | 44.35,20.9 44.35,22.68 44.86,23.19 | 44.86,23.19 44.86,24.81 SFP1_CONN.P$11 | 44.86,23.19 45.62,23.95 52.4,23.95 54.74,26.29 55.88,26.29 56.64,27.05 57.89,27.05 57.94,27 66.06,27 66.83,26.24 66.83,22.94 66.06,22.17 v64.54,22.17 | SFP1_CONN.P$14 42.38,22.87 44.35,20.9
  Bottom 0.508: v64.54,22.17 SFP1_PIN_CONN.4
SFP1_VEET_1_17_20  (via drill 0.71 pad 1.73)
  Top 0.254: v33.68,24.97 36.73,24.97 37.49,24.21 37.49,24.79 SFP1_CONN.P$20 37.58,23.1 38,22.68 39.78,22.68 40.03,22.94 40.03,24.84 SFP1_CONN.P$17 | v57.43,9.47 41.05,9.47 38,12.52 38,16.67 SFP1_CONN.P$1 37.84,16.68 36.47,15.32 36.47,11.38 v36.22,11.12
  Bottom 0.254: v33.68,24.97 33.66,24.94 33.66,17.14 34.95,15.85 34.95,12.39 v36.22,11.12
  Bottom 0.508: v57.43,9.47 SFP1_PIN_CONN.13
SFP_RD+_13
  Top 0.254: TO_ETH_SWITCH.P$13 36.12,86.64 36.27,86.49 36.27,44.55 arc93 37.31,43.56 37.85,43.56 arc-90 38.1,43.31 38.1,42.93 arc90 38.86,42.16 39.75,42.16 arc-106 40.13,41.66 40.13,40.26 40.16,40.23 arc-94 39.78,39.88 39.19,39.88 U$5.P$4
SFP_RD-_12
  Top 0.254: TO_ETH_SWITCH.P$12 36.92,86.63 36.78,86.49 36.78,44.53 arc99 37.31,44.07 38.1,44.07 arc-90 38.61,43.56 38.61,42.93 arc90 38.86,42.67 40.26,42.67 arc-90 40.64,42.29 40.66,42.27 40.66,40.23 arc94 41.05,39.88 41.15,39.88 41.15,39.54 U$4.P$4
SFP_SELECT  (via drill 0.71 pad 1.73)
  Top 0.254: U$2.P$2 33.69,34.19 | 33.69,34.19 33.91,34.42 | 33.91,34.42 33.91,35.08 U$1.P$2 33.96,34.46 33.91,34.42 | U$5.P$2 42.32,38.64 42.67,38.99 42.67,39.49 | 42.67,39.49 U$4.P$2 | 69.95,41.4 v69.98,41.4 69.98,40.01 69.22,39.24 66.29,39.24 | 33.69,34.19 33.66,34.16 29.84,34.16 29.34,34.67 29.34,37.21 v29.21,37.34 | 66.29,39.24 49.02,39.24 v48.39,38.61 | 42.67,39.49 42.67,41.66 42.93,41.91 63.63,41.91 66.29,39.24
  Bottom 0.254: SFP_DIS_SEL_FROM_LS_CONN.3 64.26,29.9 64.26,32 65.15,32.89 68.96,32.89 69.98,33.91 v69.98,41.4 | v29.21,37.34 48.01,37.34 48.26,37.59 48.26,38.48 v48.39,38.61
SFP_TD+_18
  Top 0.254: TO_ETH_SWITCH.P$18 32.12,86.63 31.98,86.49 31.98,35.71 arc90 32.23,35.46 32.56,35.46 32.56,35.22 U$1.P$4
SFP_TD-_19
  Top 0.254: TO_ETH_SWITCH.P$19 31.32,86.64 31.47,86.49 31.47,35.74 arc-90 31.22,35.48 30.69,35.48 arc-90 U$2.P$4
SW_LOS_8
  Bottom 0.254: TO_ETH_SWITCH.P$8 36.52,86.43 34.54,84.46 34.54,83.82 34.16,83.44 34.16,75.18 32.89,73.91 32.89,54.61 37.59,49.91 37.59,44.32 39.37,42.55 61.09,42.55 64.01,39.62 64.01,37.67 SW_PIN_CONN.3
SW_MOD-DEF(0)_6
  Bottom 0.254: TO_ETH_SWITCH.P$6 34.93,86.36 33.53,84.96 33.53,84.33 33.15,83.95 33.15,75.69 31.88,74.42 31.88,53.98 36.58,49.28 36.58,43.81 38.86,41.53 57.15,41.53 58.93,39.75 58.93,37.67 SW_PIN_CONN.7
SW_MOD-DEF(1)_5
  Bottom 0.254: TO_ETH_SWITCH.P$5 34.04,87.71 34.04,86.23 33.02,85.22 33.02,84.58 32.64,84.2 32.64,75.95 31.37,74.68 31.37,53.72 36.07,49.02 36.07,43.56 38.61,41.02 55.12,41.02 56.39,39.75 56.39,37.67 SW_PIN_CONN.9
SW_MOD-DEF(2)_4
  Bottom 0.254: 53.85,37.67 SW_PIN_CONN.11 53.72,37.74 53.72,39.75 52.96,40.51 38.35,40.51 35.56,43.31 35.56,48.77 30.86,53.47 30.86,74.93 32.13,76.2 32.13,84.46 32.51,84.84 32.51,85.47 33.4,86.36 33.4,87.72 TO_ETH_SWITCH.P$4
SW_RATESELECT_7
  Bottom 0.254: TO_ETH_SWITCH.P$7 35.69,87.76 35.69,86.36 34.04,84.71 34.04,84.07 33.66,83.69 33.66,75.44 32.39,74.17 32.39,54.23 37.08,49.53 37.08,44.07 39.12,42.04 59.18,42.04 61.47,39.75 61.47,37.67 SW_PIN_CONN.5
SW_TXDISABLE_3
  Bottom 0.254: TO_ETH_SWITCH.P$3 32.64,87.68 32.64,87.25 32.51,87.12 32.51,86.23 32,85.73 32,85.09 31.62,84.71 31.62,76.45 30.35,75.18 30.35,53.21 35.05,48.51 35.05,43.05 38.1,40.01 50.93,40.01 51.31,39.62 51.31,37.67 SW_PIN_CONN.13
SW_TXFAULT_2
  Bottom 0.254: 51.31,35.08 SW_PIN_CONN.14 51.23,35.05 43.82,35.05 43.31,34.54 43.31,32.77 41.78,31.24 41.78,28.45 40.64,27.3 35.31,27.3 33.53,29.08 19.56,29.08 15.62,25.15 10.92,25.15 9.4,26.67 9.4,32.38 9.78,32.77 9.78,37.08 9.72,37.15 11.18,38.61 11.18,41.66 11.94,42.42 30.99,42.42 31.37,42.8 31.37,44.96 32.26,45.85 34.29,45.85 34.54,46.1 34.54,48.26 29.84,52.96 29.84,75.44 31.12,76.71 31.12,84.96 31.5,85.34 31.5,85.98 31.75,86.23 31.75,87.77 TO_ETH_SWITCH.P$2
SW_VCCR_15  (via drill 0.71 pad 1.73)
  Top 0.254: TO_ETH_SWITCH.P$15 34.54,87.97 34.54,86.11 33.78,85.34 33.78,85.09 33.53,84.84 33.53,51.43 35.18,49.78 35.18,43.69 37.72,41.15 37.72,38.23 36.96,37.47 36.96,31.5 37.59,30.86 39.12,30.86 39.5,31.24 39.5,34.29 40.13,34.92 40.13,36.58 40.89,37.34 44.58,37.34 45.85,36.07 45.85,32.89 47.12,31.62 56.26,31.62 v56.39,31.75
  Bottom 0.254: SW_PIN_CONN.10 56.36,32.79 v56.39,31.75
SW_VCCT_16  (via drill 0.71 pad 1.73)
  Top 0.254: v61.47,32.77 61.47,31.12 60.71,30.35 55.37,30.35 54.61,31.12 46.86,31.12 45.34,32.64 45.34,35.81 44.32,36.83 41.15,36.83 40.64,36.32 40.64,34.67 40.01,34.04 40.01,30.99 39.37,30.35 37.34,30.35 36.45,31.24 36.45,37.72 37.21,38.48 37.21,40.89 34.67,43.43 34.67,49.53 33.02,51.18 33.02,85.34 33.72,86.04 TO_ETH_SWITCH.P$16
  Bottom 0.254: SW_PIN_CONN.6 61.44,32.79 v61.47,32.77
SW_VEET_1_17_20  (via drill 0.71 pad 1.73)
  Top 0.254: TO_ETH_SWITCH.P$20 30.52,44.49 v29.84,43.81 | TO_ETH_SWITCH.P$17 32.89,88.17 32.89,85.98 32.51,85.6 32.51,48.06 v33.3,47.27
  Bottom 0.254: SW_PIN_CONN.12 53.85,35.08 53.85,33.78 53.34,33.27 50.42,33.27 49.28,34.42 44.2,34.42 43.94,34.16 43.94,32.64 42.29,30.99 42.29,28.19 40.89,26.8 35.05,26.8 33.27,28.58 19.81,28.58 15.88,24.64 10.67,24.64 8.89,26.42 8.89,32.64 9.27,33.02 9.27,37.34 9.21,37.4 10.67,38.86 10.67,42.04 11.56,42.93 28.96,42.93 v29.84,43.81 29.97,43.81 30.61,44.45 30.61,45.59 32.26,47.24 | TO_ETH_SWITCH.P$1 30.92,85.53 30.61,85.22 30.61,76.96 29.34,75.69 29.34,49.78 31.88,47.24 32.26,47.24 | 32.26,47.24 33.27,47.24 v33.3,47.27
VCC  (via drill 0.71 pad 1.73)
  Top 0.254: U$2.P$1 30.69,33.53 34.04,33.53 34.61,34.1 U$1.P$1 34.61,36.2 C4.2 | C1.2 26.67,39.31 | U$5.P$1 38.23,37.03 C3.2 38.42,36.32 38.73,36.32 39.88,37.47 40.13,37.47 40.77,38.1 42.55,38.1 43.31,38.86 43.31,39.5 U$4.P$1 43.27,40.6 43.43,40.77 C2.2 44.64,39.18 48.13,35.69 48.13,33.15 v48.39,32.89 | 30.73,33.4 29.72,33.4 28.58,34.54 28.58,35.81 27.69,36.7 27.69,38.16 C1.2 | C1.2 26.6,37.78 26.42,37.59 23.11,37.59 v21.84,36.32 | v21.84,34.04 18.54,34.04 15.49,37.08 8.51,37.08 6.48,39.12 6.48,40.64 5.72,41.4 3.68,41.4 1.52,39.24 1.52,9.42 3.96,6.99 66.67,6.99 66.87,7.18 67.31,7.62 | 67.31,7.62 68.83,9.14 v68.83,24.64 | 67.31,7.62 v69.72,7.62
  Top 0.406: U$2.P$1 30.73,33.54 30.73,33.4
  Bottom 0.254: v48.39,32.89 53.85,27.43 68.83,27.43 | SFP_DIS_SEL_FROM_LS_CONN.1 69.47,29.77 69.47,28.07 68.83,27.43 | v21.84,34.04 v21.84,36.32 | v68.83,24.64 68.83,27.43 | LEDS_AND_POWER.4 70.74,8.64 v69.72,7.62
(copper drawn outside any net)
  shapes: Bottom area x2

### Text on the board
Document: TCC - George Redivo - 2013/2 - rev0